# Altium schematic sheet Power_sheet.SchDoc
size A3; SheetNumber: 2; SheetTotal: 3
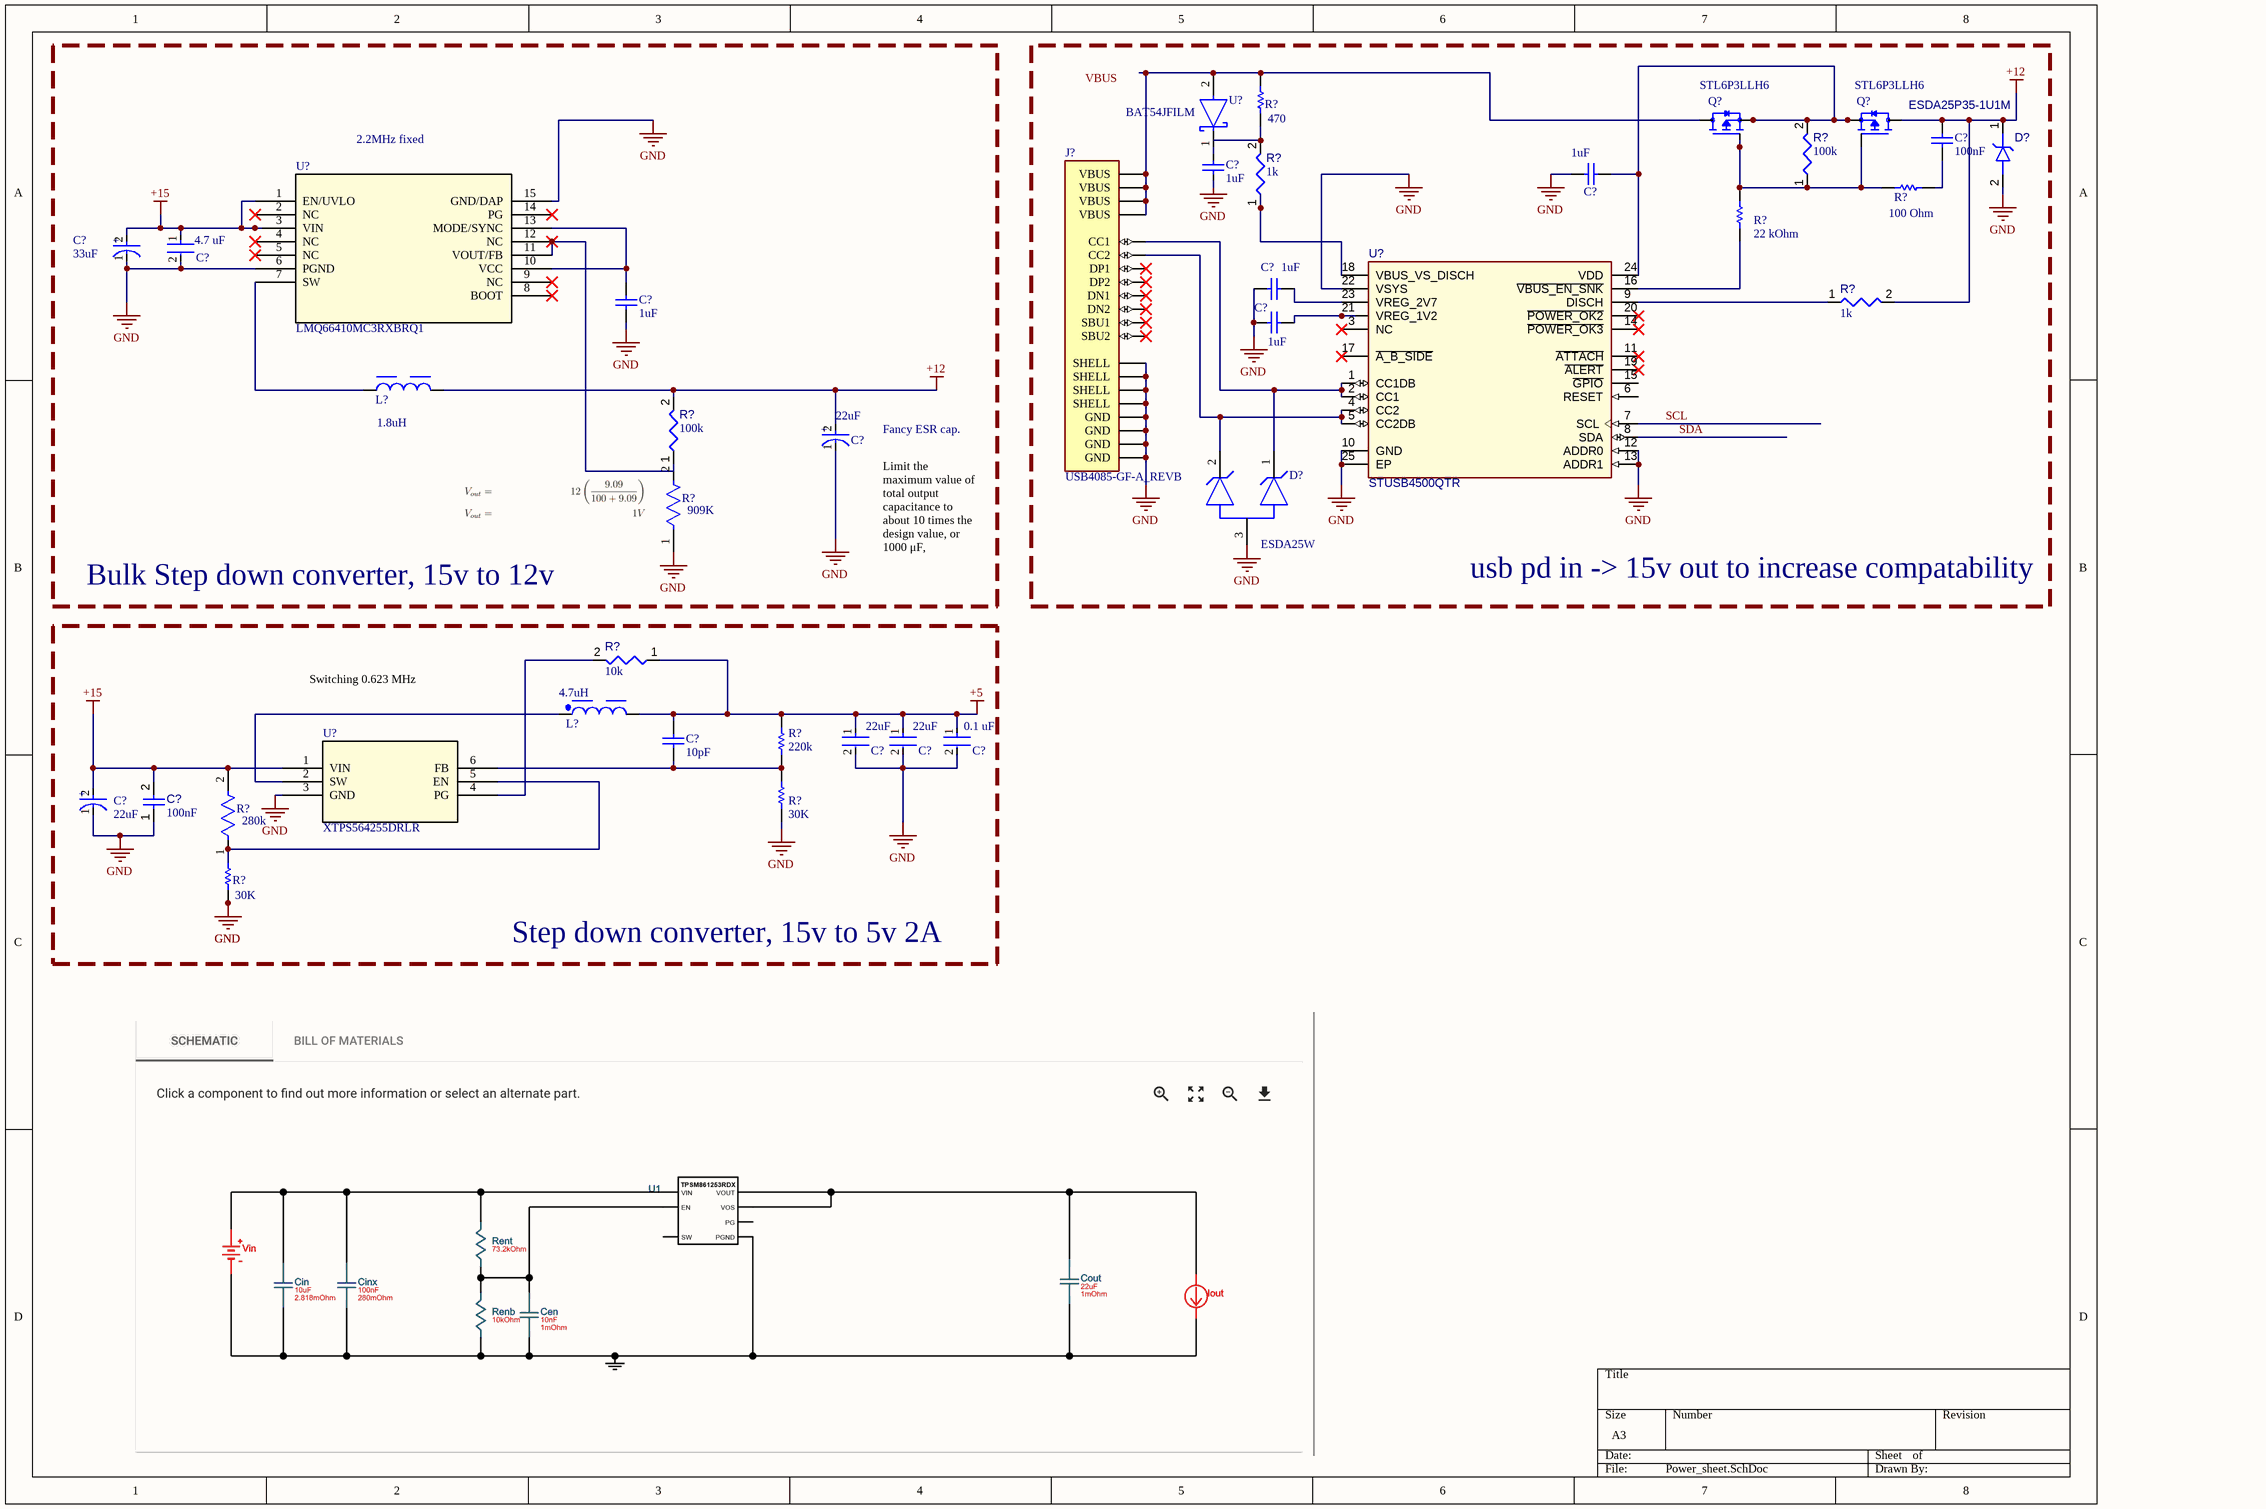
[diagram p0: Power_sheet.SchDoc]

## Parts
(Parts that share a designator on the sheet are numbered #1, #2 ... from top to bottom, then left to right.)
C?#1  value 100nF  [WCAP-CSGP_0603_L1.6W0.8H0.8_Reflow]  (hidden comment: 885012206020)
C?#2  1uF  [WCAP-CSGP_0603_L1.6W0.8H0.8_Reflow]
C?#3  1uF  [WCAP-CSGP_0603_L1.6W0.8H0.8_Reflow]
C?#4  33uF  [FP-ECAS-D4-MFG]
C?#5  4.7 uF  [FP-GRM31C-0_2-e0_3_0_8-IPC_C]
C?#6  1uF  [WCAP-CSGP_0603_L1.6W0.8H0.8_Reflow]
C?#7  1uF  [WCAP-CSGP_0603_L1.6W0.8H0.8_Reflow]
C?#8  1uF  [WCAP-CSGP_0603_L1.6W0.8H0.8_Reflow]
C?#9  22uF  [FP-ECAS-D3-MFG]
C?#10  22uF  [FP-GRM21B-0_2-e0_2_0_7-MFG]
C?#11  22uF  [FP-GRM21B-0_2-e0_2_0_7-MFG]
C?#12  0.1 uF  [FP-CGA3E-0_3-0_1-MFG]
C?#13  value 10pF  [CAPC1005X55X25LL05T10]  (hidden comment: GRM1555C1H100GA01D)
C?#14  22uF  [FP-ECAS-D3-MFG]
C?#15  value 100nF  [CAPC2013X95X50LL10T25]  (hidden comment: Capacitor 100 nF +/-10% 50 V 0805)
D?#1  ESDA25P35-1U1M  [STM-QFN1610]
D?#2  ESDA25W  [FP-SOT323-3L-IPC_C]
J?  USB4085-GF-A_REVB  [GCT_USB4085-GF-A_REVB]
L?#1  1.8uH  [WE-LHMI_7030]
L?#2  4.7uH  [WE-MAPI_4030]
Q?#1  STL6P3LLH6  [TRANS_STL6P3LLH6]
Q?#2  STL6P3LLH6  [TRANS_STL6P3LLH6]
R?#1  470  [RESC1608X55X30NL15T15]
R?#2  value 100k  [RESC1608X55X25ML10T15]  (hidden comment: Resistor 100k +/-1% 0603 100 mW)
R?#3  100 Ohm  [RESC1609X50X30ML8T20]
R?#4  value 1k  [RESC1005X40X25ML10T10]  (hidden comment: Resistor 1k +/-5% 0402 63 mW)
R?#5  22 kOhm  [RESC1608X55X25ML10T15]
R?#6  value 1k  [RESC1608X55X25ML10T15]  (hidden comment: Resistor 1k +/-1% 0603 100 mW)
R?#7  value 100k  [RESC1608X55X25ML10T15]  (hidden comment: Resistor 100k +/-1% 0603 100 mW)
R?#8  909K  [FP-RG3216-IPC_A]
R?#9  value 10k  [RESC1608X55X25ML10T15]  (hidden comment: Resistor 10k +/-1% 0603 100 mW)
R?#10  220k  [RESC1608X55X25LL10T15]
R?#11  30K  [RESC1609X50X30NL10T20]
R?#12  280k  [FP-CRCW0603-e3-IPC_B]
R?#13  30K  [RESC1609X50X30NL10T20]
U?#1  BAT54JFILM  [FP-SOD323-IPC_B]
U?#2  LMQ66410MC3RXBRQ1  [VQFN-FCRLF14_RXB_TEX]
U?#3  STUSB4500QTR  [STM-QFN-24_V]
U?#4  XTPS564255DRLR  [TPS564242DRLR_TEX]

## Blocks framed on the sheet
Bulk Step down converter, 15v to 12v: C?#4 C?#5 C?#7 C?#9 L?#1 R?#7 R?#8 U?#2
usb pd in -> 15v out to increase compatability: C?#1-C?#3 C?#6 C?#8 D?#1 D?#2 J? Q?#1 Q?#2 R?#1-R?#6 U?#1 U?#3
Step down converter, 15v to 5v 2A: C?#10-C?#15 L?#2 R?#9-R?#13 U?#4

## Nets
+5: C?#10.1 C?#11.1 C?#12.1 C?#13.2 L?#2.2 R?#9.1 R?#10.2
+12: C?#1.2 C?#9.2(A) D?#1.1(A) L?#1.2 Q?#2.5_8(D) R?#6.2 R?#7.2
+15: C?#4.2(A) C?#5.1 C?#14.2(A) C?#15.2 R?#12.2 U?#2.1(EN/UVLO) U?#2.3(VIN) U?#4.1(VIN)
GND: C?#2.1 C?#3.1 C?#4.1(C) C?#5.2 C?#6.1 C?#7.1 C?#8.1 C?#9.1(C) C?#10.2 C?#11.2 C?#12.2 C?#14.1(C) C?#15.1 D?#1.2(A) D?#2.3(COMMON_ANODE) J?.A1(GND) J?.A12(GND) J?.B1(GND) J?.B12(GND) J?.S1(SHELL) J?.S2(SHELL) J?.S3(SHELL) J?.S4(SHELL) R?#8.1 R?#11.1 R?#13.1 U?#2.6(PGND) U?#2.15(GND/DAP) U?#3.10(GND) U?#3.12(ADDR0) U?#3.13(ADDR1) U?#3.22(VSYS) U?#3.25(EP) U?#4.3(GND)
SCL: U?#3.7(SCL)
SDA: U?#3.8(SDA)
NetC?#1_1: C?#1.1 R?#3.2
NetC?#2_2: C?#2.2 Q?#1.1(S) Q?#1.2(S) Q?#1.3(S) Q?#2.1(S) Q?#2.2(S) Q?#2.3(S) R?#2.2 U?#3.24(VDD)
NetC?#3_2: C?#3.2 U?#1.1(C)
NetC?#6_2: C?#6.2 U?#3.23(VREG_2V7)
NetC?#7_2: C?#7.2 U?#2.10(VCC) U?#2.13(MODE/SYNC)
NetC?#8_2: C?#8.2 U?#3.21(VREG_1V2)
NetC?#13_1: C?#13.1 R?#10.1 R?#11.2 U?#4.6(FB)
NetD?#2_1: D?#2.1(1_CATHODE) J?.A5(CC1) U?#3.1(CC1DB) U?#3.2(CC1)
NetD?#2_2: D?#2.2(2_CATHODE) J?.B5(CC2) U?#3.4(CC2) U?#3.5(CC2DB)
NetJ?_A4: J?.A4(VBUS) J?.A9(VBUS) J?.B4(VBUS) J?.B9(VBUS) Q?#1.5_8(D) R?#1.1 U?#1.2(A)
NetL?#1_1: L?#1.1 U?#2.7(SW)
NetL?#2_1: L?#2.1 U?#4.2(SW)
NetQ?#1_4: Q?#1.4(G) Q?#2.4(G) R?#2.1 R?#3.1 R?#5.2
NetR?#1_2: R?#1.2 R?#4.2
NetR?#4_1: R?#4.1 U?#3.18(VBUS_VS_DISCH)
NetR?#5_1: R?#5.1 U?#3.16(~{VBUS_EN_SNK})
NetR?#6_1: R?#6.1 U?#3.9(DISCH)
NetR?#7_1: R?#7.1 U?#2.11(VOUT/FB) U?#2.12(NC)
NetR?#9_2: R?#9.2 U?#4.4(PG)
NetR?#12_1: R?#12.1 R?#13.2 U?#4.5(EN)

Not connected (* = marked no-connect by the designer): J? A6(DP1)* A7(DN1)* A8(SBU1)* B6(DP2)* B7(DN2)* B8(SBU2)*; R?#8 2; U?#2 2(NC)* 4(NC)* 5(NC)* 8(BOOT)* 9(NC)* 14(PG)*; U?#3 3(NC)* 6(RESET) 11(~{ATTACH})* 14(~{POWER_OK3})* 15(~{GPIO}) 17(~{A_B_SIDE})* 19(~{ALERT})* 20(~{POWER_OK2})*

## Notes on the sheet
- 2.2MHz fixed
- (near C?#9) Fancy ESR cap.
- (near C?#9) Limit the maximum value of total output capacitance to about 10 times the design value, or 1000 μF,
- Switching 0.623 MHz
- Labels drawn without touching a wire or pin: VBUS
- (in symbol CMP-001-00087-1) +
- (in symbol CMP-001-00089-1) +

## Library data of the parts
C?#1 = CMP-00000-1: Capacitor 100nF Multilayer Ceramic MLCC10 V , X7R Dielectric 0603 Surface Mount; Voltage Rating (DC): 10V; Insulation Resistance: 5GR; Tolerance: 10%; Case Code (Metric): 1608; Height: 800um; Length: 0.063inch; RoHS Compliant: Yes; Min Operating Temperature: -55°C; Reach SVHC Compliant: Unknown; Voltage Rating: 10V; Width: 0.031inch; Case/Package: 0603; Mounting Technology: Surface Mount; Thickness: 0.034inch; Case Code (Imperial): 0603; Packaging: Cut Tape; Max Operating Temperature: 125°C; Series: WCAP-CSGP; Dielectric: X7R
C?#2 C?#3 C?#6-C?#8 = CMP-001-00085-1: Capacitor Multilayer Ceramic 1uF MLCC 10 V X7R Dielectric 0603 Surface Mount
C?#4 = CMP-001-00089-1: Aluminum Polymer Capacitor 33uF 20% 25V 2-Pin Surface Mount Emboss T/R, ECASD41E336M040KA0
C?#5 = CMP-001-00088-1: Multilayer Ceramic Capacitor, 4.7 uF, 50 V, ± 10%, X7R, 1206 [3216 Metric]
C?#9 C?#14 = CMP-001-00087-1: Cap Alum Poly 22UF 20% 25V SMD, ECASD31E226M040KA0
C?#10 C?#11 = CMP-009-00186-1: Multilayer Ceramic Capacitor, 22 uF, 10 V, ± 20%, X5R, 0805 [2012 Metric]
C?#12 = CMP-001-00091-1: Multilayer Ceramic Capacitor, 0.1 uF, 50 V, ± 10%, X7R, 0603 [1608 Metric]
C?#13 = CMP-001-00090-1: Cap Ceramic 10pF 50V C0G 2% SMD 0402 125C T/R; Case Code (Metric): 1005; Case Code (Imperial): 0402; Case/Package: 0402
C?#15 = CMP-001-00018-6: Chip Capacitor, 100 nF, +/- 10%, 50 V, 0805 (2012 Metric); Capacitor Type: Ceramic; Voltage Rating: 50V; Pins: 2; Max Operating Temperature: 125°C; Min Operating Temperature: -55°C; Mounting Technology: SM; Case/Package: 0805; RoHS Compliant: True; Tolerance: 10%
D?#1 = CMP-004-00023-3: TVS DIODE 22V 41V 1610; Peak Inverse Voltage: 23.3V; Max Surge Current: 35A; Mounting Technology: SMT; Case/Package: QFN1610 (0603); RoHS Compliant: Yes; Pins: 2
D?#2 = CMP-004-00033-1: ESDA Series 2 Channel 25 V 65 pF SMT Uni-Directional Transil Array - SOT-323
J? = CMP-007-000000-1: USB-C (USB TYPE-C) USB 2.0 æ’åº§è¿žæŽ¥å™¨ 24 (16+8 Dummy) ä½é€šå­”ã€ç›´è§’ã€ä½Žæˆæœ¬ã€3.46mm å¤–å½¢ã€16 é’ˆã€æ°´å¹³ã€é¡¶éƒ¨å®‰è£…; MF: Global Connector Technology; Value: *; Check_prices: https://www.snapeda.com/parts/USB4085-GF-A/Global+Connector+Technology/view-part/?ref=eda; Component Type: Standard; Package: None; Pin Count: 20; MP: USB4085-GF-A; Source: USB4085-GF-A_REVB.SchLib; Design Item ID: USB4085-GF-A_REVB; SnapEDA_Link: https://www.snapeda.com/parts/USB4085-GF-A/Global+Connector+Technology/view-part/?ref=snap
L?#1 = CMP-006-00021-1: Inductor Power Shielded Wirewound 1.8uH 20% 100KHz Powdered Iron 6.8A 17mOhm DCR T/R
L?#2 = CMP-006-00023-1: General Purpose Inductor, 4.7uH, 20%, 1 Element, SMD, 1616
Q?#1 Q?#2 = CMP-009-000000-1: P-Channel 30 V 6A (Tc) 2.9W (Tc) Surface Mount PowerFlatâ„¢ (3.3x3.3); MF: STMicroelectronics; MP: STL6P3LLH6; Component Type: Standard; Availability: In Stock; Value: *; Check_prices: https://www.snapeda.com/parts/STL6P3LLH6/STMicroelectronics/view-part/?ref=eda; Pin Count: 5; Purchase-URL: https://pricing.snapeda.com/search/part/STL6P3LLH6/?ref=eda; Price: None; Package: None; Design Item ID: STL6P3LLH6; SnapEDA_Link: https://www.snapeda.com/parts/STL6P3LLH6/STMicroelectronics/view-part/?ref=snap; Source: STL6P3LLH6.SchLib
R?#1 = CMP-009-00183-1: SMD Chip Resistor, 470 Ohm, ± 1%, 100 mW, 0603 [1608 Metric], Thick Film, Precision
R?#2 R?#7 = CMP-009-00023-5: Chip Resistor, 100 KOhm, +/- 1%, 0.1 W, -55 to 155 degC, 0603 (1608 Metric); Voltage Rating: 50V; Power: 100mW; Max Operating Temperature: 155°C; RoHS Compliant: True; Tolerance: 1%; Pins: 2; Case/Package: 0603; Mounting Technology: SM; Min Operating Temperature: -55°C
R?#3 = CMP-009-00182-1: SMD Chip Resistor, 100 Ohm, ± 1%, 100 mW, 0603 [1608 Metric], Thick Film, General Purpose
R?#4 = CMP-009-00013-5: Chip Resistor, 1 KOhm, +/- 5%, 0.063 W, -55 to 155 degC, 0402 (1005 Metric); Power: 63mW; Tolerance: 5%; Case/Package: 0402; Mounting Technology: SM; Min Operating Temperature: -55°C; Pins: 2; Max Operating Temperature: 155°C; RoHS Compliant: True
R?#5 = CMP-009-00181-1: SMD Chip Resistor, 22 kOhm, ± 1%, 100 mW, 0603 [1608 Metric], Thick Film, General Purpose
R?#6 = CMP-009-00014-5: Chip Resistor, 1 KOhm, +/-1%, 0.1 W, -55 to 155 degC, 0603 (1608 Metric); Voltage Rating: 50V; Power: 100mW; Tolerance: 1%; Mounting Technology: SM; Pins: 2; Case/Package: 0603; Min Operating Temperature: -55°C; RoHS Compliant: True; Max Operating Temperature: 155°C
R?#8 = CMP-008-00005-1: Res SMD 909K Ohm 0.5% 1/4W 1206, RG3216N-9093-D-T5
R?#9 = CMP-009-00017-5: Chip Resistor, 10 KOhm, +/- 1%, 01 W, -55 to 155 degC, 0603 (1608 Metric); Voltage Rating: 50V; Power: 100mW; RoHS Compliant: True; Min Operating Temperature: -55°C; Pins: 2; Case/Package: 0603; Mounting Technology: SM; Max Operating Temperature: 155°C; Tolerance: 1%
R?#10 = CMP-009-00185-1: SMD Chip Resistor, 220 kOhm, ± 1%, 100 mW, 0603 [1608 Metric], Thick Film, General Purpose, RC0603FR-07220KL; Case/Package: 0603; Case Code (Metric): 1608; Case Code (Imperial): 0603
R?#11 R?#13 = CMP-009-00184-1: SMD Chip Resistor, 30 kOhm, ± 5%, 100 mW, 0603 [1608 Metric], Thick Film, General Purpose
R?#12 = CMP-008-00006-1: SMD Chip Resistor, 280 kOhm, ± 1%, 100 mW, 0603 [1608 Metric], Thick Film, General Purpose
U?#1 = CMP-00027-00002-1: Rectifier Diode, Schottky, 1 Phase, 1 Element, 0.3A, 40V V(RRM), Silicon
U?#2 = LMQ66410MC3RXBRQ1: No Description Available; Mfr_Name: Texas Instruments; Type: Power Management; RefDes: RefDes
U?#3 = CMP-019-00042-3: Standalone USB PD Sink Controller with Short-to-VBUS Protections, 4.1 to 22 V, -45 to 105 degC, 24-Pin QFN, RoHS, Tape and Reel; Pins: 25
U?#4 = XTPS564255DRLR: No Description Available; Mfr_Name: Texas Instruments; Type: Power Management; RefDes: RefDes